# EAGLE design headstage-programmer (EAGLE 8.3.2)
DESIGNER: Jon Newman; DESIGN_NAME: Headstage Programmer; LICENSE: CERN OHL v1.2; REVISION: 1.3
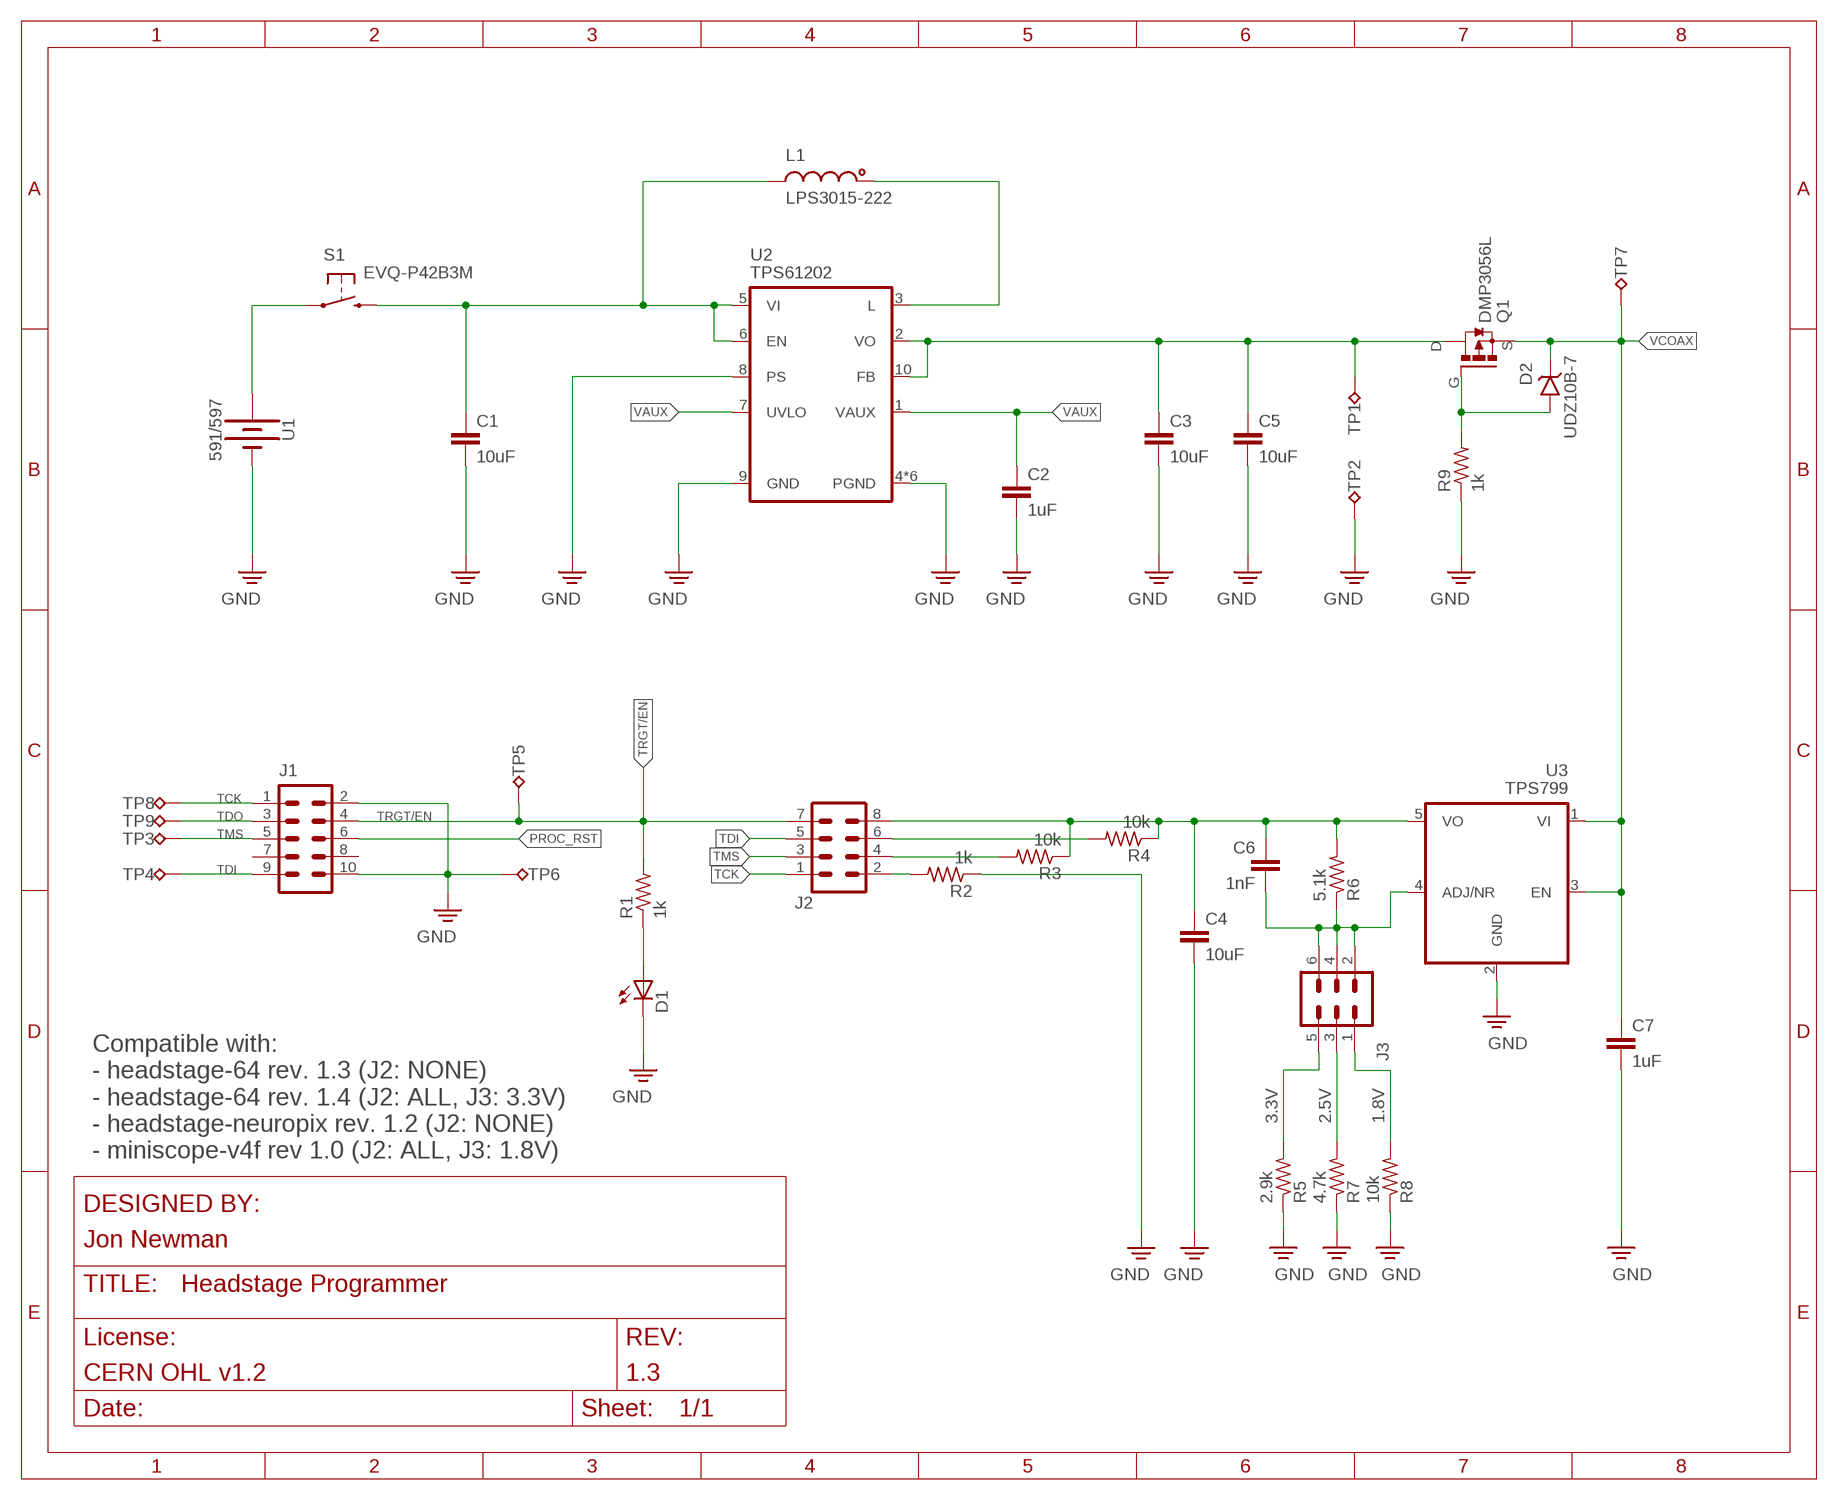
[diagram p0: schematic, sheet 1]

## Parts
C1  10uF  C_0805  [0805]
C2  1uF  C_0603  [0603]
C3  10uF  C_0805  [0805]
C4  10uF  C_0805  [0805]
C5  10uF  C_0805  [0805]
C6  1nF  C_0402  [0402]
C7  1uF  C_0603  [0603]
D1  LED_0603  [LED-0603]
D2  UDZ10B-7  Z-DIODE_SOD-323  [SOD-323]
J1  302-S101  PINHD-2X5_IDC  [2X05_IDC]
J2  PINHD-2X4_0.05"  [2X04-0.05"]
J3  PINHD-2X3_0.05"  [2X03-0.05"]
L1  LPS3015-222  L_LPS3015  [LPS3015]
Q1  DMP3056L  P-MOSFET_SOT23-GSD  [SOT23-GSD]
R1  1k  R_0402  [0402]
R2  1k  R_0402  [0402]
R3  10k  R_0402  [0402]
R4  10k  R_0402  [0402]
R5  2.9k  R_0402  [0402]
R6  5.1k  R_0402  [0402]
R7  4.7k  R_0402  [0402]
R8  10k  R_0402  [0402]
R9  1k  R_0402  [0402]
S1  EVQ-P42B3M  SPST_TACT2_EVQP4  [EVQP4]
TP1  TP_1MM  [TESTPOINT_1MM]
TP2  TP_1MM  [TESTPOINT_1MM]
TP3  TP_S500-6350-P2  [POGO_S500-6350-P2]
TP4  TP_S500-6350-P2  [POGO_S500-6350-P2]
TP5  TP_S500-6350-P2  [POGO_S500-6350-P2]
TP6  TP_S500-6350-P2  [POGO_S500-6350-P2]
TP7  TP_S500-6350-P2  [POGO_S500-6350-P2]
TP8  TP_S500-6350-P2  [POGO_S500-6350-P2]
TP9  TP_S500-6350-P2  [POGO_S500-6350-P2]
U1  591/597  BATTERY_597/591  [597/591_AAA-HOLDER]
U2  TPS61202  TPS61200  [PWSON-N10+4-3X3]
U3  TPS799  LDO_ADJUST_TPS799  [SOT-23-5]

## Nets
GND: C1.2 C2.2 C3.2 C4.2 C5.2 C7.2 D1.C J1.2 J1.10 R2.1 R5.1 R7.1 R8.1 R9.1 TP2.1(TP) TP6.P$1(TP) U1.-1(-) U1.-2(-) U1.-3(-) U2.4(PGND) U2.8(PS) U2.9(GND) U2.PAD1(PGND) U2.PAD2(PGND) U2.PAD3(PGND) U2.PAD4(PGND) U2.PAD(PGND) U3.2(GND)
N$1: D1.A R1.1
N$2: J2.2 R2.2
N$3: L1.1 U2.3(L)
N$4: S1.1(P) U1.+1(+) U1.+2(+) U1.+3(+)
N$6: C6.2 J3.2 J3.4 J3.6 R6.1 U3.4(ADJ/NR)
N$7: J2.4 R3.2
N$8: J3.1 R8.2
N$9: J3.3 R7.2
N$10: J3.5 R5.2
N$11: J2.6 R4.2
N$450: D2.A Q1.G R9.2
PROC_RST: J1.6
PWR: C3.1 C5.1 Q1.D TP1.1(TP) U2.2(VO) U2.10(FB)
TCK: J1.1 J2.1 TP8.P$1(TP)
TDI: J1.9 J2.5 TP4.P$1(TP)
TDO: J1.3 TP9.P$1(TP)
TMS: J1.5 J2.3 TP3.P$1(TP)
TRGT/EN: J1.4 J2.7 R1.2 TP5.P$1(TP)
VAUX: C2.1 U2.1(VAUX) U2.7(UVLO)
VCOAX: C7.1 D2.C Q1.S TP7.P$1(TP) U3.1(VI) U3.3(EN)
VEN: C4.1 C6.1 J2.8 R3.1 R4.1 R6.2 U3.5(VO)
VIN: C1.1 L1.2 S1.2(S) U2.5(VI) U2.6(EN)
Unconnected: J1.7 J1.8

## Notes on the sheet
- 3.3V | 2.5V | 1.8V
- Compatible with:
  - headstage-64 rev. 1.3 (J2: NONE)
  - headstage-64 rev. 1.4 (J2: ALL, J3: 3.3V)
  - headstage-neuropix rev. 1.2 (J2: NONE)
  - miniscope-v4f rev 1.0 (J2: ALL, J3: 1.8V)

## Library data of the parts
C1 C3-C5 = jonnew:C: Capacitor; MN: TDK Corp.; PARTNO: C2012X5R1Cxxxxxxx; VID: DK
C2 C6 C7 = jonnew:C: Capacitor
D1 = jonnew:LED: Surface mount LED
D2 = jonnew:Z-DIODE: Zener Diode; PARTNO: UDZ10B-7
J1 = jonnew:PINHD-2X5
J2 = jonnew:PINHD-2X4
J3 = jonnew:PINHD-2X3
L1 = jonnew:L: Inductor
Q1 = jonnew:P-MOSFET; PARTNO: DMP3056L-7
R1-R9 = jonnew:R: Resistor
S1 = jonnew:SPST_TACT2
TP1-TP9 = jonnew:TP: Test pad
U1 = jonnew:BATTERY
U2 = jonnew:TPS61200
U3 = jonnew:LDO_ADJUST

## Board
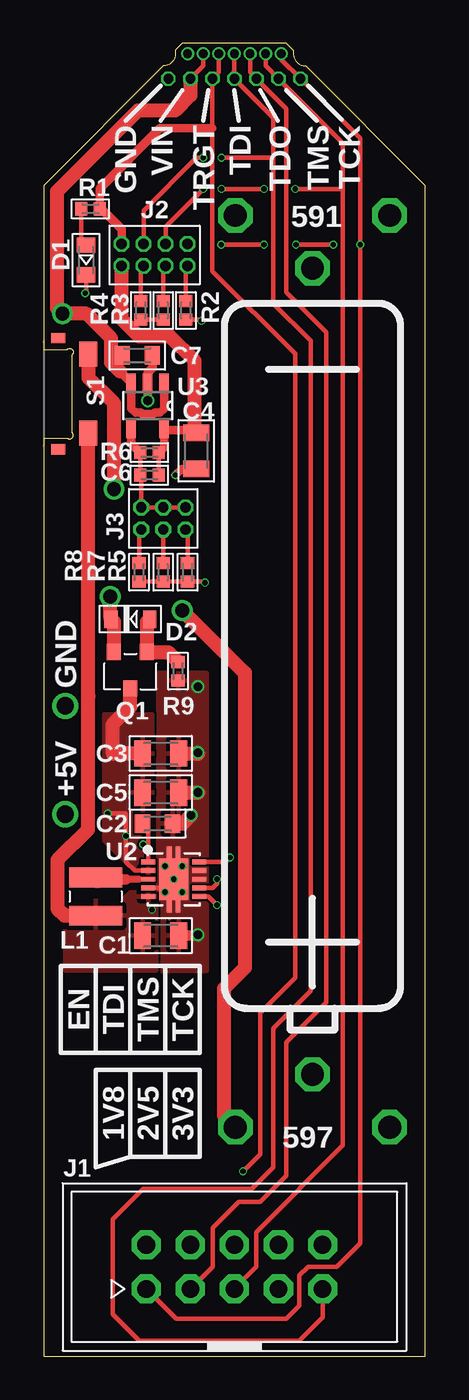
[diagram p1: board, top side]
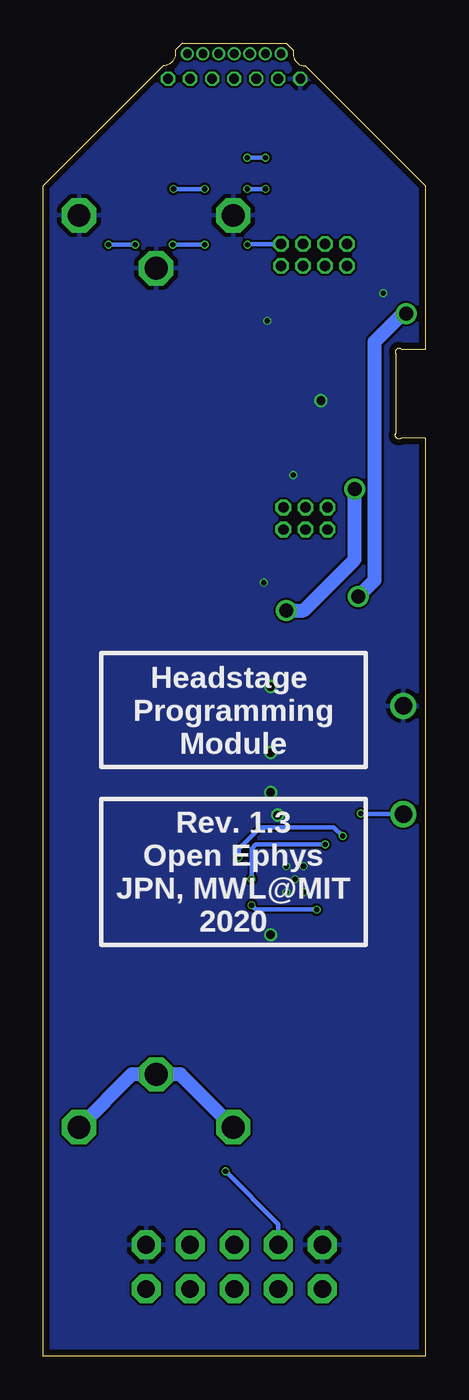
[diagram p2: board, bottom side, seen from below]

Size 22 x 75.7 mm. Coordinates in mm from the lower left corner, seen from the top.
Outline: 0,58.05 0,67.5 6.9,74.4 arc90 7.6,75.1 7.6,75.3 8,75.7 14,75.7 14.4,75.3 14.4,75.1 arc90 15.1,74.4 22,67.5 22,0 0,0 0,52.95
Copper layers (1*16): Top 0.0356mm / dielectric 1.5011mm / Bottom 0.0356mm
Design rules "ohs-park-2-layer *": minimum track width 6mil, minimum drill 10mil, track to track 5mil, track to pad 5mil, pad to pad 5mil, via to via 5mil, smd to smd 5mil, copper to edge 15mil, drill to drill 6mil, minimum pad ring 2mil, minimum via ring 1mil, stop-mask expansion 3mil, vias tented up to drill 100mil, thermal gap 10mil

### Footprints (pad centres in the part's own frame; a part is rotated, then mirrored left to right if it is on the bottom)
0805 = smd 0.965 x 1.524: 1 -1.041,0; 2 1.041,0
0603 = smd 0.889 x 1.067: 1 -0.864,0; 2 0.864,0
0402 = smd 0.686 x 0.762: 1 -0.533,0; 2 0.533,0
LED-0603 = smd 1.067 x 0.889: A 0,-0.864; C 0,0.864
SOD-323 = smd 0.762 x 1.016: A -1.118,0; C 1.118,0
2X05_IDC = drill 1.016 pad 1.676 octagon: 1 -5.08,-1.27; 2 -5.08,1.27; 3 -2.54,-1.27; 4 -2.54,1.27; 5 0,-1.27; 6 0,1.27; 7 2.54,-1.27; 8 2.54,1.27; 9 5.08,-1.27; 10 5.08,1.27
2X04-0.05" = drill 0.6 octagon: 1 -1.905,-0.635; 2 -1.905,0.635; 3 -0.635,-0.635; 4 -0.635,0.635; 5 0.635,-0.635; 6 0.635,0.635; 7 1.905,-0.635; 8 1.905,0.635
2X03-0.05" = drill 0.6 octagon: 1 -1.27,-0.635; 2 -1.27,0.635; 3 0,-0.635; 4 0,0.635; 5 1.27,-0.635; 6 1.27,0.635
LPS3015 = smd 1.14 x 3.05: 1 -1.1,0; 2 1.1,0
SOT23-GSD = smd 0.8 x 0.9: D 0,0; G -0.95,-2.1; S 0.95,-2.1
EVQP4 = smd 1.45 x 1.05: 1 -2.275,2.575; 2 2.275,2.575 | smd 0.6 x 0.8: 3 -3.2,0.85; 4 3.2,0.85
TESTPOINT_1MM = drill 1: 1 0,0
POGO_S500-6350-P2 = drill 0.55 octagon: P$1 0,0
597/591_AAA-HOLDER = drill 1.321 octagon: +1 -4.445,3.048; +2 0,0; +3 4.445,3.048; -1 -4.445,-49.53; -2 0,-46.482; -3 4.445,-49.53
PWSON-N10+4-3X3 = smd 0.8 x 0.28: 1 -1.475,1; 2 -1.475,0.5; 3 -1.475,0; 4 -1.475,-0.5; 5 -1.475,-1; 6 1.475,-1; 7 1.475,-0.5; 8 1.475,0; 9 1.475,0.5; 10 1.475,1 | smd 1.65 x 2.4: PAD 0,0 | smd 0.28 x 0.7: PAD1 -0.25,1.55; PAD2 0.25,1.55; PAD3 0.25,-1.55; PAD4 -0.25,-1.55
SOT-23-5 = smd 0.55 x 1: 1 -0.95,-1.35; 2 0,-1.35; 3 0.95,-1.35; 4 0.95,1.35; 5 -0.95,1.35

### Placement (x,y rotation side)
C1  6.75,24.25 0 top
C2  6.57,30.71 0 top
C3  6.75,34.75 0 top
C4  8.8,52.2 270 top
C5  6.75,32.5 0 top
C6  6.1,50.8 180 top
C7  5.4,57.7 0 top
D1  2.45,63.2 180 top
D2  5,42.5 180 top
J1  11,5.15 0 top
J2  6.4,63.5 180 top
J3  6.9,48.3 0 top
L1  3,26.5 270 top
Q1  5,38.5 180 top
R1  2.7,66.15 0 top
R2  8.2,60.3 90 top
R3  6.9,60.3 90 top
R4  5.6,60.3 90 top
R5  8.3,45.2 90 top
R6  6.1,52.1 0 top
R7  6.9,45.2 90 top
R8  5.5,45.2 90 top
R9  7.75,39.5 90 top
S1  0,55.5 270 top
TP1  1.25,31.25 0 top
TP2  1.25,37.5 0 top
TP3  13.54,73.66 180 top
TP4  11,73.66 180 top
TP5  9.73,73.66 180 top
TP6  7.19,73.66 180 top
TP7  8.46,73.66 180 top
TP8  14.81,73.66 180 top
TP9  12.27,73.66 180 top
U1  15.5,16.25 180 top
U2  7.5,27.5 0 top
U3  6,54.8 180 top

### Tracks (layer width: path | path; a pad name or v marks a point on that pad's centre or on a via)
GND  (via drill 0.3, 0.5)
  Top 0.25: U2.4 6.75,27 v7,26.75 | R8.1 R7.1 R5.1 9.23,44.67 v9.3,44.6 | D1.C 2.45,61.35 v2.4,61.3 | R2.1 9.03,59.77 v9.1,59.7
  Top 0.5: v6,55.1 U3.2 6,56.7 6.3,57 6.3,57.66 C7.2 | C4.2 7.96,51.16 v7.6,50.8
  Top 0.61: 8.9,38.64 v8.9,38.6 | 8.9,34.75 v8.9,34.8 | C1.2 8.9,24.25 v8.9,24.3
  Top 0.8: C3.2 8.9,34.75 | C5.2 v8.9,32.5 | C2.2 8.01,30.71 v8.5,31.2
  other vias: 7,28.25 8,28.25 8,26.75 7.5,27.5
  pour Bottom: -17.75,-12 -17.75,93.75 40,93.75 40,-12
  pour Top (rank 4): 6.6,22.2 6.6,39.4 9.4,39.4 9.4,22.2
  pour Top (rank 3, no thermals): 9.4,29.7 6.6,29.7 6.6,25.3 9.4,25.3
N$1
  Top 0.25: D1.A 2.17,64.35 R1.1
N$2
  Top 0.25: 8.2,62.76 J2.2 8.2,62.76 | 8.2,62.76 R2.2
N$3
  Top 0.25: U2.3 5.5,27.5
  Top 0.406: 5.5,27.5 4.75,27.5
  Top 0.61: 4.75,27.5 3.1,27.5
  Top 1: 3.1,27.5 L1.1
N$4  (via drill 0.8)
  Top 0.8: U1.+3 10.4,13.86 10.4,21.2 11.6,22.4 11.6,39.4 v8,43 | v4.06,50 4.06,54.94 2.6,56.4 2.6,57.9 2.57,57.88 S1.1
  Bottom 0.8: U1.+3 14.1,16.25 U1.+2 16.9,16.25 U1.+1 | v8,43 7,43 4.06,45.94 v4.06,50
N$5  (via drill 0.5 pad 0.54)
  other vias: 8.3,75.1
N$6
  Top 0.25: J3.6 J3.4 J3.2 5.63,50.74 C6.2 R6.1
  Top 0.5: U3.4 5.05,52.62 R6.1
N$7
  Top 0.25: J2.4 6.9,62.73 R3.2
N$8
  Top 0.25: R8.2 5.5,47.53 J3.1
N$9
  Top 0.25: R7.2 J3.3
N$10
  Top 0.25: R5.2 8.3,47.53 J3.5
N$11
  Top 0.25: R4.2 5.6,62.7 J2.6
N$450
  Top 0.8: R9.2 7.18,40.6 Q1.G 5.95,42.33 D2.A
PWR  (via drill 0.3)
  Top 0.25: v10.75,28.75 10.5,28.5 U2.10 | U2.2 5.25,28 4.75,28.5 v4.75,30 4.75,31.25 4.7,31.3 v3.7,31.3
  Top 0.8: C3.1 4,34.75 4,36.44 5,37.44 Q1.D
  Bottom 0.25: v10.75,28.75 10.75,29.25 9.5,30.5 5.25,30.5 v4.75,30 | TP1.1 3.65,31.25 v3.7,31.3
  pour Top (rank 2): 6.25,27.75 6.25,37 3.5,37 3.5,29.75 5.5,27.75
TCK  (via drill 0.3, 0.5 pad 0.55)
  Top 0.25: J1.1 7.65,2.15 14,2.15 14.75,2.9 14.75,4.65 15.25,5.15 16.9,5.15 18.25,6.5 v18.25,64.1 18.25,70.22 TP8.P$1 13.7,74.77 v13.7,75.1 | v10.23,64.1 v12.7,64.1 | v14.55,64.1 v16.7,64.1
  Bottom 0.25: J2.1 10.2,64.14 v10.23,64.1 | v12.7,64.1 v14.55,64.1 | v16.7,64.1 v18.25,64.1
TDI  (via drill 0.3, 0.5 pad 0.55)
  Top 0.25: J1.9 16.08,2.23 14.75,0.9 5.5,0.9 4,2.4 4,7.9 5.75,9.65 12,9.65 13.25,10.9 13.25,18.9 15.4,21.05 15.4,58.55 13.25,60.7 13.25,69 | 13.25,69 13.25,71.41 TP4.P$1 v11,75.1 | J2.5 5.76,66.06 8.8,69.1 v9.2,69.1 | v10.25,69.1 13.15,69.1 13.25,69
  Bottom 0.25: v9.2,69.1 v10.25,69.1
TDO  (via drill 0.5 pad 0.55)
  Top 0.25: J1.3 8.48,3.88 9.75,5.15 9.75,7.4 11.25,8.9 12.5,8.9 14,10.4 14,18.1 16.3,20.4 16.3,59.05 14,61.35 14,71.93 TP9.P$1 11.9,74.03 v11.9,75.1
TMS  (via drill 0.3, 0.5 pad 0.55)
  Top 0.25: J1.5 11,3.9 12.25,5.15 12.25,7.15 17.25,12.15 17.25,67.3 | 17.25,67.3 17.25,69.95 TP3.P$1 12.8,74.4 v12.8,75.1 | J2.3 7.04,65.14 v9.2,67.3 | v12.7,67.3 v10.25,67.3 | v14.5,67.3 17.25,67.3
  Bottom 0.25: v12.7,67.3 v14.5,67.3 | v10.25,67.3 v9.2,67.3
TRGT/EN  (via drill 0.3, 0.5 pad 0.55)
  Top 0.25: v11.5,10.65 12.5,11.65 12.5,19.8 14.5,21.8 14.5,57.8 9.73,62.57 9.73,70.8 TP5.P$1 10.1,74.03 v10.1,75.1 | 3.28,66.2 R1.2
  Top 0.5: J2.7 4.5,64.99 3.28,66.2 | R1.2 3.23,67.33 6.7,70.8 9.73,70.8
  Bottom 0.25: J1.4 8.46,7.61 v11.5,10.65
VAUX  (via drill 0.3)
  Top 0.25: 6.03,29.5 U2.1 | v5.75,29.5 6.03,29.5 | U2.7 9.75,27 10,27.25 v10,27.5 | C2.1 6.03,30.39 6.03,29.5
  Bottom 0.25: v5.75,29.5 9.75,29.5 10,29.25 v10,27.5
VCOAX  (via drill 0.5 pad 0.55, 0.8)
  Top 0.25: v3.85,43.8 4,43.95 4,44 | v9.2,75.1 9.2,74.4 TP7.P$1
  Top 0.5: U3.1 6.95,54.65 6.7,54.4 6.4,54.4 6.32,54.32 5.68,54.32 5.6,54.4 5.3,54.4 5.05,54.65 U3.3 4.4,56.8 | C7.1 4.3,57.7 3.9,57.3
  Top 0.8: v3.85,43.8 3.85,42.58 arc45 D2.C 4.05,42.33 Q1.S | TP7.P$1 8.46,72.7 7.58,71.82 5.43,71.82 0.79,67.17 0.79,60.41 v1.09,60.11 2.49,60.11 3.9,58.7 3.9,57.3 4.4,56.8
  Bottom 0.8: v1.09,60.11 1.29,60.11 2.9,58.5 2.9,44.75 v3.85,43.8
VEN
  Top 0.25: R6.2 C6.1 | R3.1 R4.1 | R4.1 5.57,59.77 5.5,59.7 5.53,59.7 R4.1 | R4.1 5.1,59.27 5.1,59.2
  Top 0.5: R6.2 6.95,52.42 U3.5 7,53.4 8.6,53.4 | C4.1 8.8,53.4 8.7,53.5
  Top 0.8: J2.8 4.5,59.8 5.1,59.2 5.5,58.8 7.3,58.8 8.7,57.4 8.7,53.5 arc-90 8.6,53.4
VIN  (via drill 0.3)
  Top 0.25: U2.6 9.5,26.5 v10,26
  Top 0.8: 3,25.5 L1.2 1.2,25.4 0.8,25.8 0.8,28.6 2.55,30.35 2.55,38.04 2.57,38.06 S1.2
  Bottom 0.25: v6.25,25.75 9.75,25.75 v10,26
  pour Top: 6.5,26.75 5,26.75 4.5,26.25 1.25,26.25 1.25,22.25 6.5,22.25

### Text on the board
tPlace: GND | VIN | TRGT | TDI | TDO | TMS | TCK | 591 | GND | +5V | EN | TDI | TMS | TCK | 1V8 | 2V5 | 3V3 | 597
bPlace: Headstage / Programming / Module | Rev. 1.3 / Open Ephys / JPN, MWL@MIT / 2020